# EAGLE design Counter (EAGLE 9.1.1)
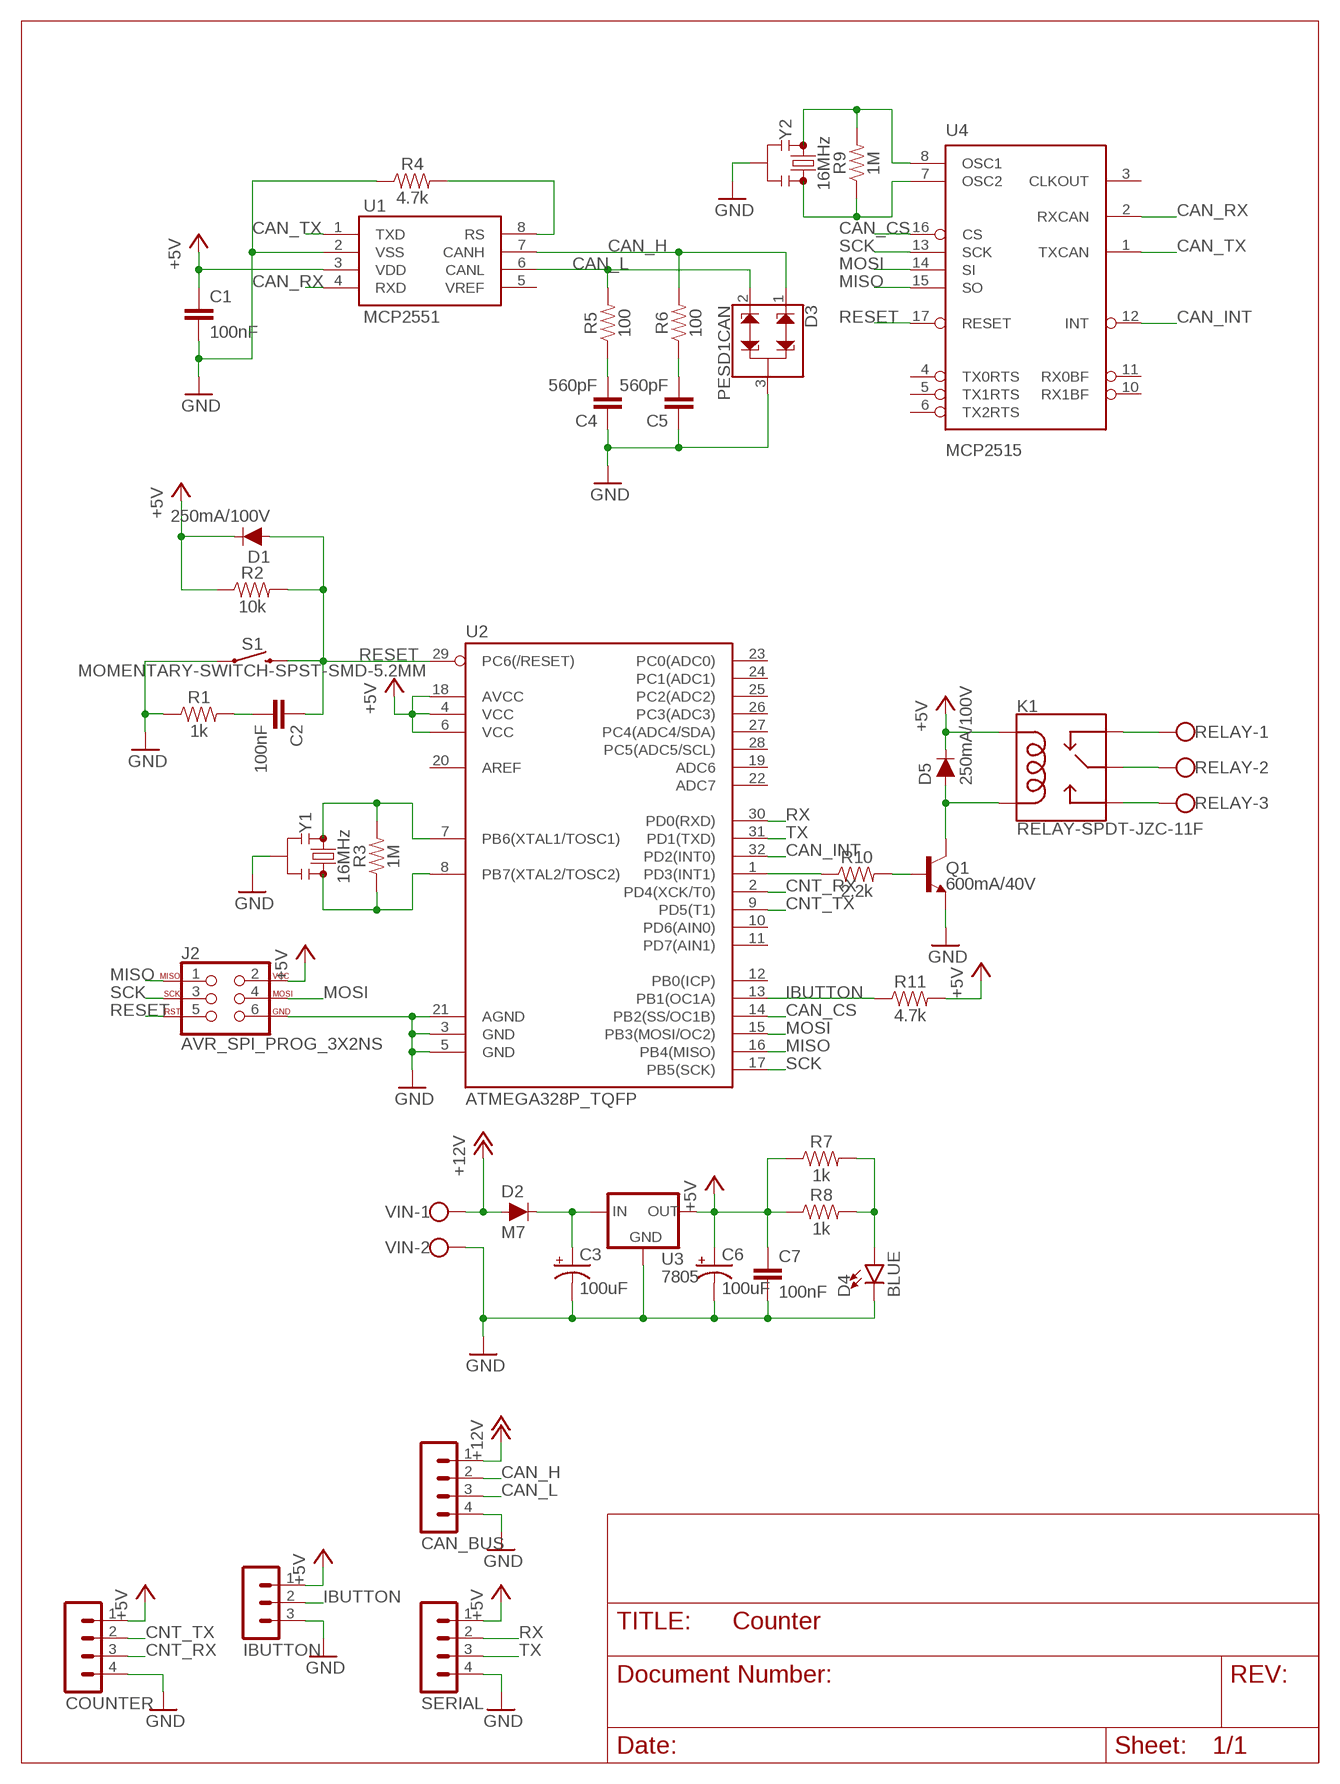
[diagram p0: schematic, sheet 1]

## Parts
C1  100nF  47NF-0603-25V-5%  [0603]
C2  100nF  47NF-0603-25V-5%  [0603]
C3  100uF  47UF-POLAR-PANASONIC_D-35V-20%  [PANASONIC_D]
C4  560pF  560PF-0603-50V-5%  [0603]
C5  560pF  560PF-0603-50V-5%  [0603]
C6  100uF  47UF-POLAR-PANASONIC_D-35V-20%  [PANASONIC_D]
C7  100nF  47NF-0603-25V-5%  [0603]
CAN_BUS  MA04-1  [MA04-1]
COUNTER  MA04-1  [MA04-1]
D1  250mA/100V  DIODE-BAS16J  [SOD-323]
D2  M7  DIODE-BAS16J  [SOD-323]
D3  PESD1CAN  [SOT23-3]
D4  BLUE  LED-BLUE0603  [LED-0603]
D5  250mA/100V  DIODE-BAS16J  [SOD-323]
IBUTTON  MA03-1  [MA03-1]
J2  AVR_SPI_PROG_3X2NS  [2X3-NS]
K1  RELAY-SPDT-JZC-11F  [RELAY-JZC]
Q1  600mA/40V  TRANS_NPN-MMBT2222AL  [SOT23-3]
R1  1k  1KOHM-0603-1/10W-1%  [0603]
R2  10k  10KOHM-0603-1/10W-1%  [0603]
R3  1M  1MOHM-0603-1/4W-5%  [0603]
R4  4.7k  4.7KOHM-0603-1/10W-1%  [0603]
R5  100  100OHM-0603-1/10W-1%  [0603]
R6  100  100OHM-0603-1/10W-1%  [0603]
R7  1k  1KOHM-0603-1/10W-1%  [0603]
R8  1k  1KOHM-0603-1/10W-1%  [0603]
R9  1M  1MOHM-0603-1/4W-5%  [0603]
R10  2.2k  2.2KOHM-0603-1/10W-1%  [0603]
R11  4.7k  4.7KOHM-0603-1/10W-1%  [0603]
RELAY  W237-103  [W237-103]
S1  MOMENTARY-SWITCH-SPST-SMD-5.2MM  [TACTILE_SWITCH_SMD_5.2MM]
SERIAL  MA04-1  [MA04-1]
U1  MCP2551  [SO08]
U2  ATMEGA328P_TQFP  [TQFP32-08]
U3  7805  V_REG_78XX7812  [TO-252]
U4  MCP2515  MCP2515(MCP2510)SO  [SO18W]
VIN  W237-102  [W237-102]
Y1  16MHz  RESONATOR-16MHZSMD_3.2X1.3  [RESONATOR-SMD-3.2X1.3]
Y2  16MHz  RESONATOR-16MHZSMD_3.2X1.3  [RESONATOR-SMD-3.2X1.3]

## Nets
+5V: C1.1 C6.+ C7.1 COUNTER.1 D1.C D5.C IBUTTON.1 J2.2 K1.5(COIL1) R2.1 R7.1 R8.1 R11.2 SERIAL.1 U1.3(VDD) U2.4(VCC) U2.6(VCC) U2.18(AVCC) U3.2(OUT)
+12V: CAN_BUS.1 D2.A VIN.1
CAN_CS: U2.14(PB2(SS/OC1B)) U4.16(CS)
CAN_H: CAN_BUS.2 D3.1 R6.2 U1.7(CANH)
CAN_INT: U2.32(PD2(INT0)) U4.12(INT)
CAN_L: CAN_BUS.3 D3.2 R5.2 U1.6(CANL)
CAN_RX: U1.4(RXD) U4.2(RXCAN)
CAN_TX: U1.1(TXD) U4.1(TXCAN)
CNT_RX: COUNTER.3 U2.2(PD4(XCK/T0))
CNT_TX: COUNTER.2 U2.9(PD5(T1))
GND: C1.2 C3.- C4.1 C5.1 C6.- C7.2 CAN_BUS.4 COUNTER.4 D3.3 D4.C IBUTTON.3 J2.6 Q1.2(E) R1.1 R4.1 S1.1 SERIAL.4 U1.2(VSS) U2.3(GND) U2.5(GND) U2.21(AGND) U3.3(GND) VIN.2 Y1.2 Y2.2
IBUTTON: IBUTTON.2 R11.1 U2.13(PB1(OC1A))
MISO: J2.1 U2.16(PB4(MISO)) U4.15(SO)
MOSI: J2.4 U2.15(PB3(MOSI/OC2)) U4.14(SI)
N$1: R3.1 U2.8(PB7(XTAL2/TOSC2)) Y1.3
N$2: C3.+ D2.C U3.1(IN)
N$3: R3.2 U2.7(PB6(XTAL1/TOSC1)) Y1.1
N$4: D4.A R7.2 R8.2
N$5: R4.2 U1.8(RS)
N$6: C2.2 R1.2
N$7: K1.4(MAIN) RELAY.2
N$8: C5.2 R6.1
N$9: C4.2 R5.1
N$10: K1.2(NC) RELAY.1
N$11: K1.3(NO) RELAY.3
N$12: Q1.1(B) R10.2
N$13: D5.A K1.1(COIL2) Q1.3(C)
N$14: R10.1 U2.1(PD3(INT1))
N$17: R9.1 U4.7(OSC2) Y2.3
N$18: R9.2 U4.8(OSC1) Y2.1
RESET: C2.1 D1.A J2.5 R2.2 S1.3 U2.29(PC6(/RESET)) U4.17(RESET)
RX: SERIAL.2 U2.30(PD0(RXD))
SCK: J2.3 U2.17(PB5(SCK)) U4.13(SCK)
TX: SERIAL.3 U2.31(PD1(TXD))
Unconnected: U1.5(VREF) U2.10(PD6(AIN0)) U2.11(PD7(AIN1)) U2.12(PB0(ICP)) U2.19(ADC6) U2.20(AREF) U2.22(ADC7) U2.23(PC0(ADC0)) U2.24(PC1(ADC1)) U2.25(PC2(ADC2)) U2.26(PC3(ADC3)) U2.27(PC4(ADC4/SDA)) U2.28(PC5(ADC5/SCL)) U4.3(CLKOUT) U4.4(TX0RTS) U4.5(TX1RTS) U4.6(TX2RTS) U4.10(RX1BF) U4.11(RX0BF)

## Power pins joined to a net without a drawn wire
+5V: U4.18(VDD)
GND: U4.9(VSS)

## Library data of the parts
C1 C2 C7 = SparkFun-Capacitors:47NF: 47nF ceramic capacitors A capacitor is a passive two-terminal electrical component used to store electrical energy temporarily in an electric field.; PROD_ID: CAP-08605; VALUE: 47nF
C3 C6 = SparkFun-Capacitors:47UF-POLAR: 47µF polarized capacitors A capacitor is a passive two-terminal electrical component used to store electrical energy temporarily in an electric field.; PROD_ID: CAP-08478; VALUE: 47uF
C4 C5 = SparkFun-Capacitors:560PF: 0.56nF/560pF ceramic capacitors A capacitor is a passive two-terminal electrical component used to store electrical energy temporarily in an electric field.; PROD_ID: CAP-08749
CAN_BUS COUNTER SERIAL = con-lstb:MA04-1: PIN HEADER; OC_FARNELL: unknown; OC_NEWARK: unknown
D1 D5 = SparkFun-DiscreteSemi:DIODE: Diode These are standard reverse protection diodes and small signal diodes. SparkFun Products: SparkFun SparkPunk Sound Kit <https://www.sparkfun.com/products/11177> SparkFun ESP8266 Thing <https://www.sparkfun.com/products/13231>; PROD_ID: DIO-09646
D2 = SparkFun-DiscreteSemi:DIODE: Diode These are standard reverse protection diodes and small signal diodes. SparkFun Products: SparkFun SparkPunk Sound Kit <https://www.sparkfun.com/products/11177> SparkFun ESP8266 Thing <https://www.sparkfun.com/products/13231>; PROD_ID: DIO-09646; VALUE: 250mA/100V
D3 = SparkFun-DiscreteSemi:PESD1CAN: CAN bus ESD protection diode PESD1CAN is used to protect two CAN bus lines from ESD. Link to datasheet <http://www.nxp.com/documents/data_sheet/PESD1CAN-U.pdf> SparkFun Products: SparkFun CAN-BUS Shield <https://www.sparkfun.com/products/13262>; PROD_ID: DIO-12501
D4 = SparkFun-LED:LED-BLUE: Blue SMD LED Used in manufacturing of various products at SparkFun Packages: 0603 - SMD 0603 package [Product Link] <http://www.digikey.com/product-detail/en/SMLE12BC7TT86/511-1589-2-ND/1641808> 1206 - SMD1206 package [Product Link] <http://www.digikey.com/product-detail/en/lite-on-inc/LTST-C150TBKT/160-1643-1-ND/573584> SparkFun Products: ESP8266 Thing-Dev Board <https://www.sparkfun.com/products/13711> RedBoard <https://www.sparkfun.com/products/12757>; PROD_ID: DIO-08575
IBUTTON = con-lstb:MA03-1: PIN HEADER; OC_FARNELL: unknown; OC_NEWARK: unknown
J2 = SparkFun-Connectors:AVR_SPI_PROG_3X2: AVR ISP 6 Pin This is the reduced ISP connector for AVR programming. Common on Arduino. This footprint will take up less PCB space and can be used with a 10-pin to 6-pin adapter such as SKU: BOB-08508 **Special note about "TEST_POINT" package. The stop mask is on the top side, so if you want your programming test points to be on the bottom of your board, make sure to place this package on the bottom side of the board. This also ensure that the orientation to program from the bottom side will be correct. SparkFun Products: SparkFun ISP Pogo Adapter <https://www.sparkfun.com/products/11591> - NS Tiny AVR Programmer <https://www.sparkfun.com/products/11801> -PTH
K1 = SparkFun-Electromechanical:RELAY-SPDT: SPDT Electromechanical Relay Single-pole, double-throw sealed relays. When current is applied to the coil, it throws a simple changeover switch, terminating the connection from the NC contact to ground and closing the NO contact. Use them to switch high voltage/high current devices. SparkFun Products JQX-15F: Relay SPDT Sealed - 20A <https://www.sparkfun.com/products/10924> (COM-10924) JZC-11F: Relay SPDT Sealed <https://www.sparkfun.com/products/100> (COM-00100); PROD_ID: COMP-09533; SF_SKU: COM-00100
Q1 = SparkFun-DiscreteSemi:TRANS_NPN: NPN transistor Current controlled devices typically used to amplify current or used as a switch. BC547 - COM-08928 <http://www.sparkfun.com/products/8928> (TO-92 45V 100mA) (1.Collector 2.Base 3.Emitter) 2N3904 - COM-00521 <http://www.sparkfun.com/products/521> (TO-92 40V 200mA) (1.Emitter 2.Base 3.Collector) P2N2222A - COM-12852 <http://www.sparkfun.com/products/12852> (TO-92 40V 600mA) (1.Collector 2.Base 3.Emitter); PROD_ID: TRANS-08049
R1 R7 R8 = SparkFun-Resistors:1KOHM: 1kΩ resistor A resistor is a passive two-terminal electrical component that implements electrical resistance as a circuit element. Resistors act to reduce current flow, and, at the same time, act to lower voltage levels within circuits. - Wikipedia; PROD_ID: RES-07856
R2 = SparkFun-Resistors:10KOHM: 10kΩ resistor A resistor is a passive two-terminal electrical component that implements electrical resistance as a circuit element. Resistors act to reduce current flow, and, at the same time, act to lower voltage levels within circuits. - Wikipedia; PROD_ID: RES-00824
R3 R9 = SparkFun-Resistors:1MOHM: 1MΩ resistor A resistor is a passive two-terminal electrical component that implements electrical resistance as a circuit element. Resistors act to reduce current flow, and, at the same time, act to lower voltage levels within circuits. - Wikipedia; PROD_ID: RES-07868
R4 R11 = SparkFun-Resistors:4.7KOHM: 4.7kΩ resistor A resistor is a passive two-terminal electrical component that implements electrical resistance as a circuit element. Resistors act to reduce current flow, and, at the same time, act to lower voltage levels within circuits. - Wikipedia; PROD_ID: RES-07857
R5 R6 = SparkFun-Resistors:100OHM: 100Ω resistor A resistor is a passive two-terminal electrical component that implements electrical resistance as a circuit element. Resistors act to reduce current flow, and, at the same time, act to lower voltage levels within circuits. - Wikipedia; PROD_ID: RES-07863
R10 = SparkFun-Resistors:2.2KOHM: 2.2kΩ resistor A resistor is a passive two-terminal electrical component that implements electrical resistance as a circuit element. Resistors act to reduce current flow, and, at the same time, act to lower voltage levels within circuits. - Wikipedia; PROD_ID: RES-08272
RELAY = con-wago-500:W237-103: WAGO SCREW CLAMP; MPN: 237-103; OC_FARNELL: unknown; OC_NEWARK: 18M7116
S1 = SparkFun-Switches:MOMENTARY-SWITCH-SPST: Momentary Switch (Pushbutton) - SPST Normally-open (NO) SPST momentary switches (buttons, pushbuttons). Variants PTH-12MM - 12mm square, through-hole Momentary Pushbutton Switch - 12mm Square <https://www.sparkfun.com/products/9190> (COM-09190) PTH-6.0MM, PTH-6.0MM-KIT - 6.0mm square, through-hole Mini Pushbutton Switch <https://www.sparkfun.com/products/97> (COM-00097) KIT package intended for soldering kit's - only one side of pads' copper is exposed. PTH-RIGHT-ANGLE-KIT - Right-angle, through-hole Right Angle Tactile Button <https://www.sparkfun.com/products/10791> - Used on SparkFun BigTime Watch Kit <https://www.sparkfun.com/products/11734> SMD-12MM - 12mm square, surface-mount Tactile Button - SMD (12mm) <https://www.sparkfun.com/products/12993> (COM-12993) Used on SparkFun PicoBoard <https://www.sparkfun.com/products/11888> SMD-4.5MM - 4.5mm Square Trackball Switch Used on SparkFun Blackberry Trackballer Breakout <https://www.sparkfun.com/products/13169> SMD-4.6MMX2.8MM - 4.60mm x 2.80mm, surface mount Used on SparkFun SAMD21 Mini Breakout <https://www.sparkfun.com/products/13664> SMD-5.2MM, SMD-5.2-REDUNDANT - 5.2mm square, surface-mount Mini Pushbutton Switch - SMD <https://www.sparkfun.com/products/8720> (COM-08720) Used on Arduino Pro Mini <https://www.sparkfun.com/products/11114> REDUNDANT package connects both switch circuits together SMD-6.0X3.5MM - 6.0 x 3.5mm, surface mount Momentary Reset Switch SMD <https://www.sparkfun.com/products/8229> (COM-08229) SMD-6.2MM-TALL - 6.2mm square, surface mount Tactile Button - SMD (6mm) <https://www.sparkfun.com/products/12992> Used on SparkFun Digital Sandbox <https://www.sparkfun.com/products/12651> SMD-RIGHT-ANGLE - Right-angle, surface mount Used on SparkFun Block for Intel® Edison - Arduino <https://www.sparkfun.com/products/13036>; PROD_ID: SWCH-08247; SF_SKU: COM-08720
U1 = SparkFun-IC-Comms:MCP2551: MCP2551 High Speed CAN Transceiver High speed CAN transceiver Datasheet <http://www.sparkfun.com/datasheets/DevTools/Arduino/MCP2551.pdf> SparkFun Products CAN-BUS Shield <https://www.sparkfun.com/products/13262> (DEV-13262) SparkFun OBD-II UART <https://www.sparkfun.com/products/9555> (WIG-09555); PROD_ID: IC-09907
U2 = SparkFun-IC-Microcontroller:ATMEGA328P_TQFP: Popular 328P in QFP Storefront component: ATmega328 - TQFP <https://www.sparkfun.com/products/13448> (COM-13448) Datasheet <http://www.sparkfun.com/datasheets/Components/SMD/ATMega328.pdf> SparkFun Products SparkFun RedBoard - Programmed with Arduino <https://www.sparkfun.com/products/12757> (DEV-12757) Arduino Pro Mini 328 - 5V/16MHz <https://www.sparkfun.com/products/11113> (DEV-11113) Arduino Pro Mini 328 - 3.3V/8MHz <https://www.sparkfun.com/products/11114> (DEV-11114) SparkFun OpenLog <https://www.sparkfun.com/products/13712> (DEV-13712) SparkFun MicroView - OLED Arduino Module <https://www.sparkfun.com/products/12923> (DEV-12923) SparkFun Digital Sandbox <https://www.sparkfun.com/products/12651> (DEV-12651) SparkFun PicoBoard <https://www.sparkfun.com/products/11888> (WIG-11888) Arduino Fio <https://www.sparkfun.com/products/10116> (DEV-10116) LilyPad Arduino 328 Main Board <https://www.sparkfun.com/products/13342> (DEV-13342) SparkFun RedStick <https://www.sparkfun.com/products/13741> (DEV-13741) LilyPad MP3 <https://www.sparkfun.com/products/11013> (DEV-11013) LilyPad Arduino SimpleSnap <https://www.sparkfun.com/products/10941> (DEV-10941) SparkFun Stepoko <https://www.sparkfun.com/products/13899> (ROB-13899) SparkFun Geiger Counter <https://www.sparkfun.com/products/11345> (SEN-11345) SparkFun EL Sequencer <https://www.sparkfun.com/products/12781> (COM-12781) Arduino Pro 328 - 5V/16MHz <https://www.sparkfun.com/products/10915> (DEV-10915) CryptoCape <https://www.sparkfun.com/products/12773> (DEV-12773) SparkFun IR Thermometer Evaluation Board - MLX90614 <https://www.sparkfun.com/products/10740> (SEN-10740) SparkFun RedBot Mainboard <https://www.sparkfun.com/products/12097> (ROB-12097) Arduino Pro 328 - 3.3V/8MHz <https://www.sparkfun.com/products/10914> (DEV-10914) SparkFun Block for Intel® Edison - Arduino <https://www.sparkfun.com/products/13036> (DEV-13036) SparkFun Simon Says - Surface Mount Soldering Kit <https://www.sparkfun.com/products/10935> (KIT-10935) SparkFun 7-Segment Serial Display - Red <https://www.sparkfun.com/products/11441> (COM-11441) SparkFun 7-Segment Serial Display - White <https://www.sparkfun.com/products/11629> (COM-11629) SparkFun 7-Segment Serial Display - Yellow <https://www.sparkfun.com/products/11443> (COM-11443) SparkFun 7-Segment Serial Display - Kelly Green <https://www.sparkfun.com/products/11440> (COM-11440) SparkFun 7-Segment Serial Display - Blue <https://www.sparkfun.com/products/11442> (COM-11442) SparkFun OpenSegment Serial Display - 20mm (Blue) <https://www.sparkfun.com/products/11647> (COM-11647) SparkFun OpenSegment Serial Display - 20mm (Green) <https://www.sparkfun.com/products/11646> (COM-11646) SparkFun OpenSegment Serial Display - 20mm (White) <https://www.sparkfun.com/products/11648> (COM-11648) SparkFun OpenSegment Serial Display - 20mm (Red) <https://www.sparkfun.com/products/11644> (COM-11644) SparkFun OpenSegment Serial Display - 20mm (Yellow) <https://www.sparkfun.com/products/11645> (COM-11645) SparkFun OpenSegment Shield <https://www.sparkfun.com/products/13190> (DEV-13190); PROD_ID: IC-09069
U3 = SparkFun-IC-Power:V_REG_78XX: Voltage Regulator Standard 78xx regulator. IGO (Input Ground Output). Spark Fun Electronics SKU : COM-00107; PROD_ID: VREG-12370; VALUE: +12v
U4 = SparkFun-IC-Comms:MCP2515(MCP2510): CAN controller with SPI interface The MCP2515 controller supercedes the MCP2510 while addressing all errata associated with it. The two devices are pin compatible, either can be used with this device. 18-pin package SOIC Simple SPI interface to any MCU. One-shot mode ensures message transmission is attempted only once Databyte filtering Start-of-Frame (SOF) output Low-power CMOS Technology Datasheet <http://www.sparkfun.com/datasheets/DevTools/Arduino/MCP2515.pdf> SparkFun Products CAN-BUS Shield <https://www.sparkfun.com/products/13262> (DEV-13262); PROD_ID: IC-09906
VIN = con-wago-500:W237-102: WAGO SCREW CLAMP; MPN: 237-102; OC_FARNELL: unknown; OC_NEWARK: 70K9898
Y1 Y2 = SparkFun-Clocks:RESONATOR-16MHZ: 16MHz Resonator Digikey Example <http://www.digikey.com/product-detail/en/murata-electronics-north-america/CSTCE16M0V53-R0/490-1198-1-ND/584635> Frequency: 16MHz Frequency Stability: ±0.3% Frequency Tolerance: ±0.5% Capacitance: 15pF SparkFun Products SparkFun OpenLog <https://www.sparkfun.com/products/13712> SparkFun MicroView - OLED Arduino Module <https://www.sparkfun.com/products/12923>; PROD_ID: XTAL-08900

## Board
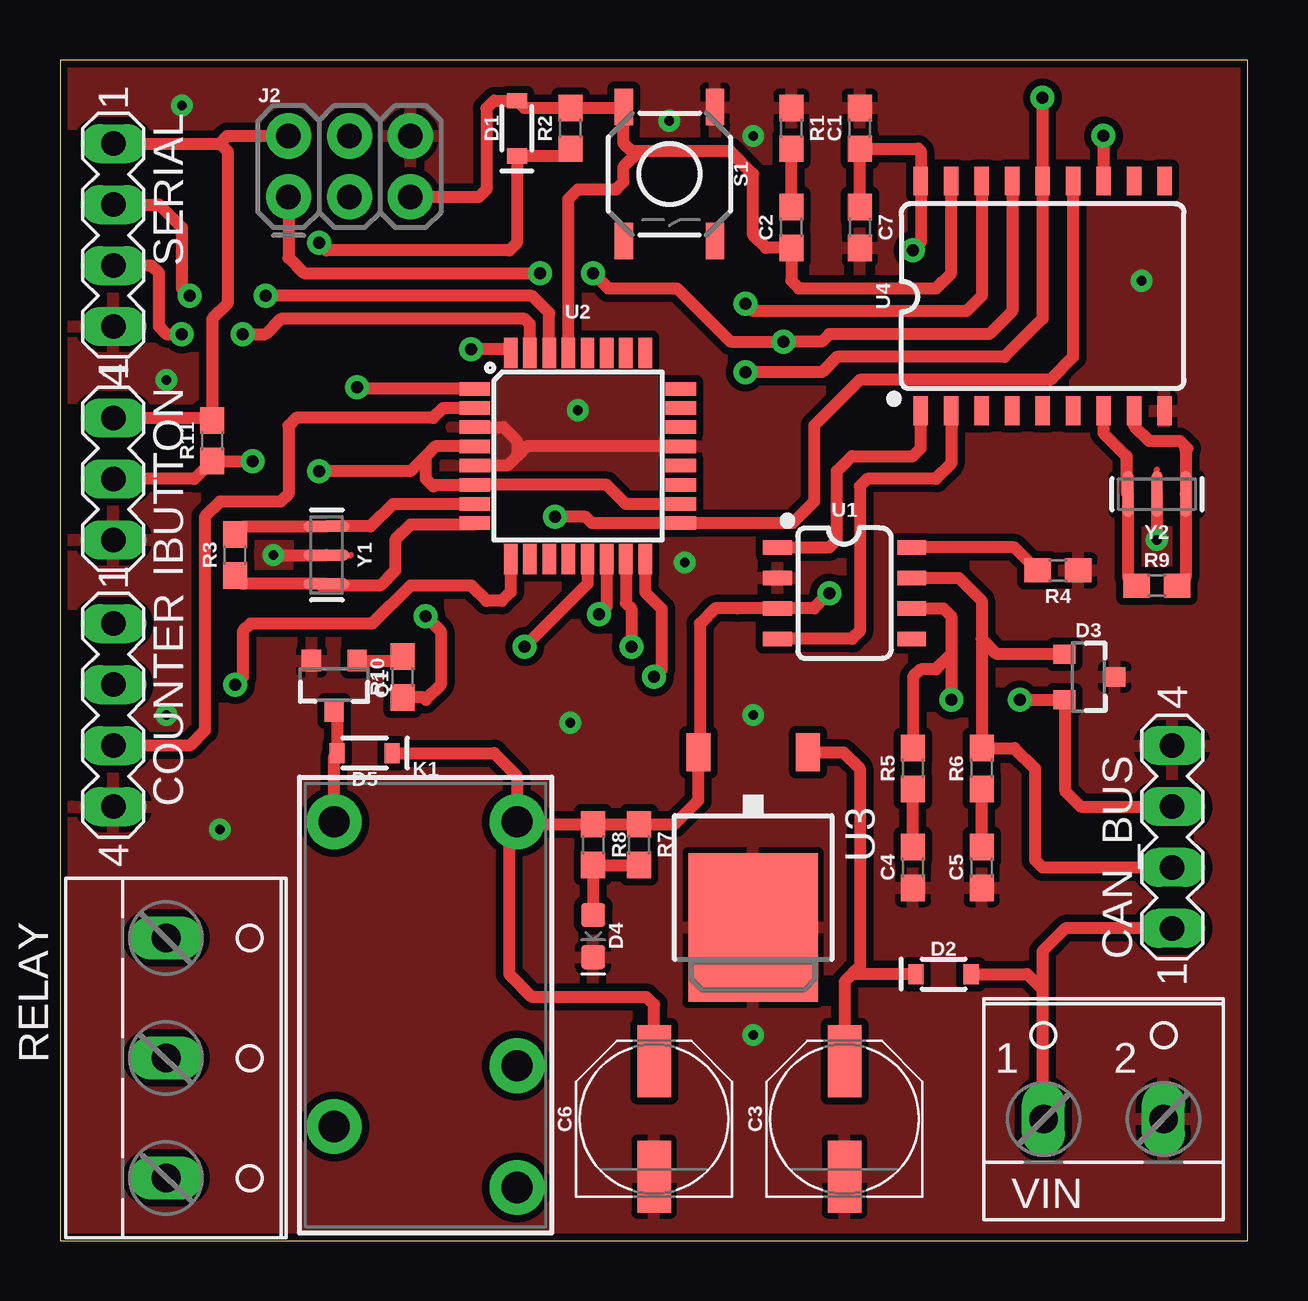
[diagram p1: board, top side]
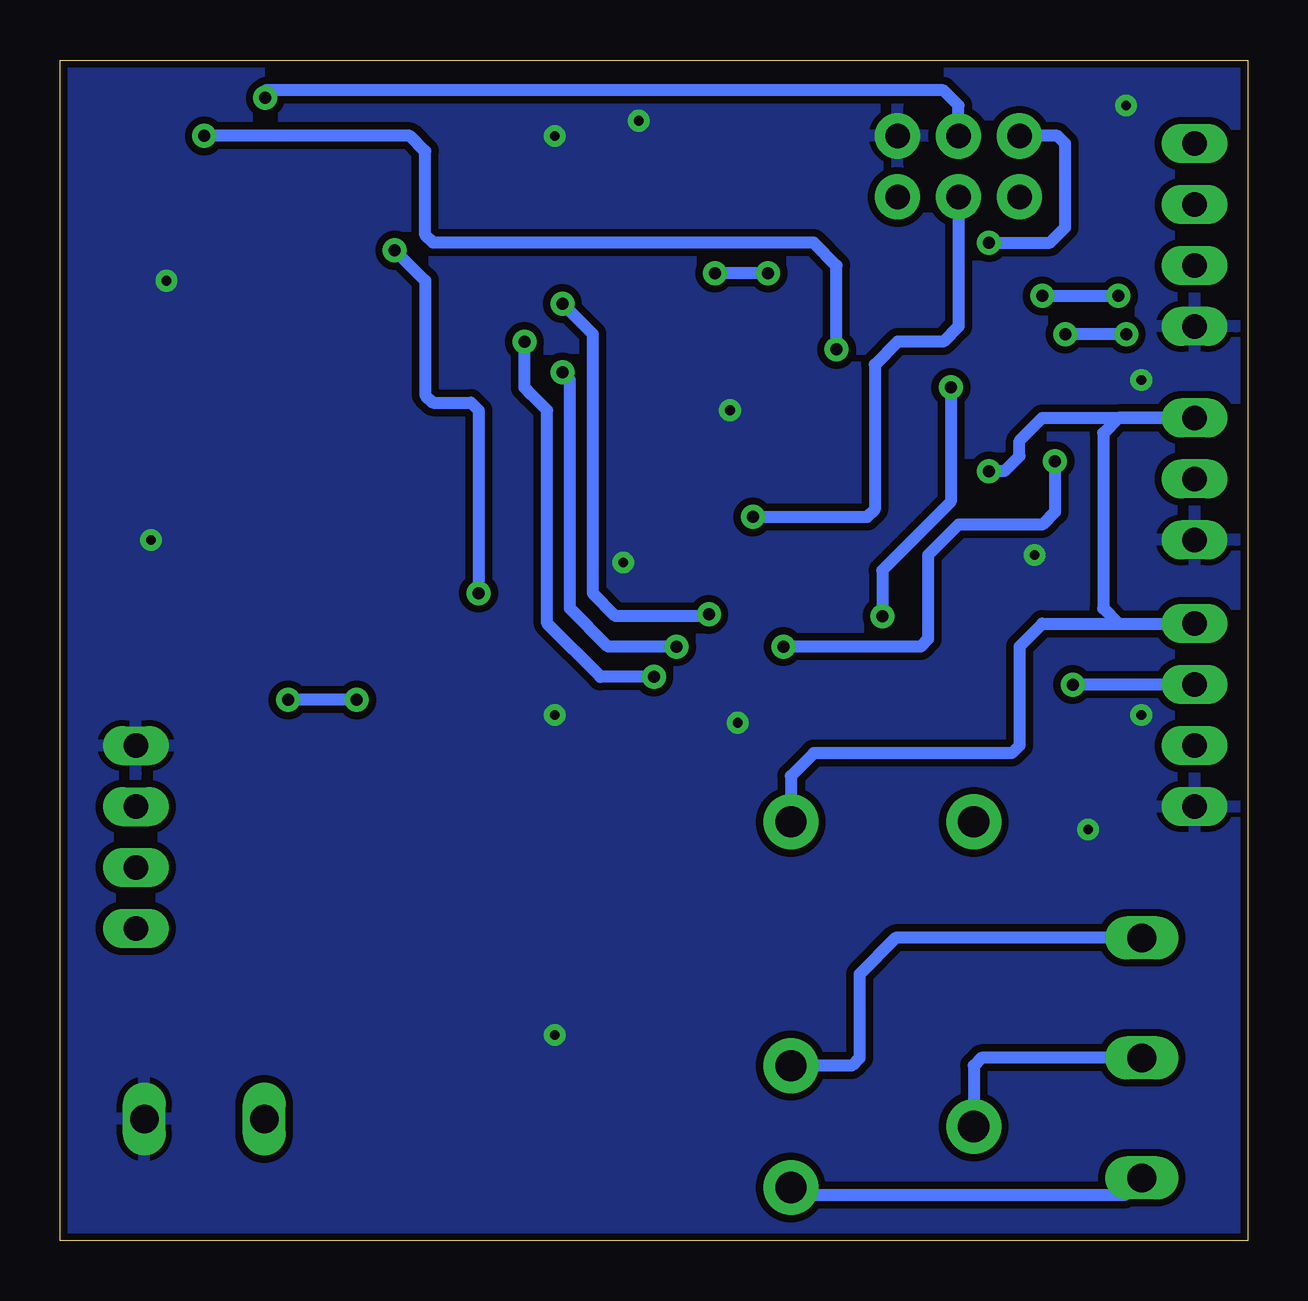
[diagram p2: board, bottom side, seen from below]

Size 49.52 x 49.2 mm. Coordinates in mm from the lower left corner, seen from the top.
Outline: 0,0 49.52,0 49.52,49.2 0,49.2 0,0
Copper layers (1*16): Top 0.035mm / dielectric 1.5mm / Bottom 0.035mm
Design rules "REVISION COLCIRCUITOS": minimum track width 0.23mm, minimum drill 0.4mm, track to track 0.2mm, track to pad 0.2mm, pad to pad 0.2mm, via to via 0.2mm, smd to smd 0mil, copper to edge 0.25mm, drill to drill 0.4mm, minimum pad ring 0.3mm, minimum via ring 0.25mm, stop-mask expansion 0.15mm, vias tented up to drill 0.001mm, thermal gap 10mil

### Footprints (pad centres in the part's own frame; a part is rotated, then mirrored left to right if it is on the bottom)
0603 = smd 1.1 x 1: 1 -0.85,0; 2 0.85,0
PANASONIC_D = smd 3 x 1.4: + 2.4,0; - -2.4,0
MA04-1 = drill 1.016 long: 1 -3.81,0; 2 -1.27,0; 3 1.27,0; 4 3.81,0
SOD-323 = smd 0.63 x 0.83: A 1.15,0; C -1.15,0
SOT23-3 = smd 0.8 x 0.9: 1 -0.95,-1; 2 0.95,-1; 3 0,1.1
LED-0603 = smd 1 x 1: A -0.877,0; C 0.877,0
MA03-1 = drill 1.016 long: 1 -2.54,0; 2 0,0; 3 2.54,0
2X3-NS = drill 1.016 pad 1.88: 1 -2.54,-1.27; 2 -2.54,1.27; 3 0,-1.27; 4 0,1.27; 5 2.54,-1.27; 6 2.54,1.27
RELAY-JZC = drill 1.3 pad 2.286: 1 3.81,-8.89; 2 -3.81,1.27; 3 -3.81,6.35; 4 3.81,3.81; 5 -3.81,-8.89
W237-103 = drill 1.194 long: 1 -5,-1.29; 2 0,-1.29; 3 5,-1.29
TACTILE_SWITCH_SMD_5.2MM = smd 1.524 x 0.762: 1 -2.794,1.905; 2 2.794,1.905; 3 -2.794,-1.905; 4 2.794,-1.905
SO08 = smd 0.6 x 1.2: 1 -1.905,-2.8; 2 -0.635,-2.8; 3 0.635,-2.8; 4 1.905,-2.8; 5 1.905,2.8; 6 0.635,2.8; 7 -0.635,2.8; 8 -1.905,2.8
TQFP32-08 = smd 1.27 x 0.559: 1 -4.293,2.8; 2 -4.293,2; 3 -4.293,1.2; 4 -4.293,0.4; 5 -4.293,-0.4; 6 -4.293,-1.2; 7 -4.293,-2; 8 -4.293,-2.8; 17 4.293,-2.8; 18 4.293,-2; 19 4.293,-1.2; 20 4.293,-0.4; 21 4.293,0.4; 22 4.293,1.2; 23 4.293,2; 24 4.293,2.8 | smd 0.559 x 1.27: 9 -2.8,-4.293; 10 -2,-4.293; 11 -1.2,-4.293; 12 -0.4,-4.293; 13 0.4,-4.293; 14 1.2,-4.293; 15 2,-4.293; 16 2.8,-4.293; 25 2.8,4.293; 26 2,4.293; 27 1.2,4.293; 28 0.4,4.293; 29 -0.4,4.293; 30 -1.2,4.293; 31 -2,4.293; 32 -2.8,4.293
TO-252 = smd 1 x 1.6: 1 -2.28,-4.8; 2 2.28,-4.8 | smd 5.4 x 6.2: 3 0,2.5
SO18W = smd 0.6 x 1.2: 1 -5.08,-4.788; 2 -3.81,-4.788; 3 -2.54,-4.788; 4 -1.27,-4.788; 5 0,-4.788; 6 1.27,-4.788; 7 2.54,-4.788; 8 3.81,-4.788; 9 5.08,-4.788; 10 5.08,4.788; 11 3.81,4.788; 12 2.54,4.788; 13 1.27,4.788; 14 0,4.788; 15 -1.27,4.788; 16 -2.54,4.788; 17 -3.81,4.788; 18 -5.08,4.788
W237-102 = drill 1.194 long: 1 -2.5,-1.27; 2 2.5,-1.27
RESONATOR-SMD-3.2X1.3 = smd 0.45 x 1.905: 1 -1.2,0; 2 0,0; 3 1.2,0

### Placement (x,y rotation side)
C1  33.34,46.35 90 top
C2  30.48,42.23 90 top
C3  32.7,5.08 90 top
C4  35.56,15.56 90 top
C5  38.42,15.56 90 top
C6  24.77,5.08 90 top
C7  33.34,42.23 270 top
CAN_BUS  46.35,16.83 90 top
COUNTER  2.22,21.91 270 top
D1  19.05,46.35 90 top
D2  36.83,11.11 0 top
D3  42.86,23.5 270 top
D4  22.23,12.7 270 top
D5  12.7,20.32 180 top
IBUTTON  2.22,31.75 270 top
J2  12.06,44.77 0 top
K1  15.24,8.57 180 top
Q1  11.43,23.18 180 top
R1  30.48,46.35 270 top
R2  21.27,46.35 90 top
R3  7.3,28.57 90 top
R4  41.59,27.94 180 top
R5  35.56,19.68 90 top
R6  38.42,19.68 90 top
R7  24.13,16.51 270 top
R8  22.23,16.51 270 top
R9  45.72,27.3 0 top
R10  14.29,23.5 90 top
R11  6.35,33.34 90 top
RELAY  5.71,7.62 270 top
S1  25.4,44.45 270 top
SERIAL  2.22,41.91 270 top
U1  32.7,26.99 270 top
U2  21.59,32.7 0 top
U3  28.89,15.56 180 top
U4  40.96,39.37 0 top
VIN  43.5,6.35 0 top
Y1  11.11,28.57 270 top
Y2  45.72,31.11 180 top

### Tracks (layer width: path | path; a pad name or v marks a point on that pad's centre or on a via)
+5V  (via drill 0.5, 0.5 pad 0.55)
  Top 0.508: 19.15,17.36 K1.5 19.05,19.37 18.1,20.32 D5.C | 19.15,17.36 R8.1 R7.1 25.61,17.36 26.61,18.36 U3.2 26.67,20.41 26.67,25.72 27.3,26.35 28.26,26.35 U1.3 31.43,26.35 v32.07,26.99 | C6.+ 24.77,9.84 24.45,10.16 19.68,10.16 18.73,11.11 18.73,16.94 19.15,17.36 | R2.1 20.97,45.2 D1.C 19.05,41.59 18.73,41.27 11.11,41.27 v10.79,41.59 | C7.1 C1.1 35.77,45.51 35.88,45.4 U4.18 35.88,41.59 v35.56,41.27 | U2.4 15.64,33.1 15.24,32.7 | 15.24,32.7 15.24,31.75 15.56,31.43 15.63,31.5 U2.6 22.79,31.5 23.59,30.7 U2.18 | 15.24,32.7 14.61,32.07 v10.79,32.07 | IBUTTON.1 6.03,34.29 6.35,34.61 R11.2 6.35,38.42 6.99,39.05 6.99,45.4 6.67,45.72 | SERIAL.1 6.67,45.72 | 6.67,45.72 6.99,46.04 J2.2
  Bottom 0.508: v10.79,32.07 10.16,32.07 9.53,32.7 9.53,33.34 8.57,34.29 IBUTTON.1 5.4,34.29 6.03,33.66 6.03,26.35 5.4,25.72 | v35.56,41.27 34.29,40.01 34.29,35.24 33.97,34.92 32.38,34.92 32.07,34.61 v32.07,26.99 | v10.79,41.59 8.26,41.59 7.62,42.23 7.62,45.72 7.94,46.04 J2.2 | K1.5 19.05,19.37 18.1,20.32 17.46,20.32 9.84,20.32 9.53,20.64 9.53,24.77 8.57,25.72 5.71,25.72 5.4,25.72 | 5.4,25.72 COUNTER.1
+12V
  Top 0.508: CAN_BUS.1 41.91,13.02 40.96,12.06 40.96,10.48 | VIN.1 40.96,5.12 40.96,10.48 | D2.A 40.32,11.11 40.96,10.48
CAN_CS  (via drill 0.5 pad 0.55)
  Top 0.508: U4.16 38.42,39.37 37.78,38.73 31.83,38.73 31.83,38.74 31.04,38.74 31.04,38.73 28.89,38.73 v28.57,39.05 | U2.14 22.79,26.42 v22.47,26.11
  Bottom 0.508: v28.57,39.05 27.46,37.94 27.3,37.78 27.3,26.99 26.35,26.04 22.54,26.04 v22.47,26.11
CAN_H
  Top 0.508: U1.7 37.47,27.62 38.42,26.67 38.42,25.08 | 38.42,25.08 R6.2 39.79,20.54 40.64,19.68 40.64,15.88 40.96,15.56 CAN_BUS.2 | D3.1 39.05,24.45 38.42,25.08
CAN_INT  (via drill 0.5 pad 0.55)
  Top 0.508: U2.32 18.64,37.15 v17.14,37.15 | v43.5,46.04 U4.12
  Bottom 0.508: v17.14,37.15 17.14,40.64 18.1,41.59 33.97,41.59 34.29,41.91 34.29,45.4 34.92,46.04 v43.5,46.04
CAN_L  (via drill 0.5 pad 0.55)
  Top 0.508: U1.6 36.83,26.35 37.15,26.04 37.15,24.45 | 37.15,24.45 36.51,23.81 35.88,23.81 35.56,23.5 R5.2 | v37.15,22.54 37.15,24.13 37.15,24.45 | v40.01,22.54 D3.2 41.86,22.27 41.91,22.23 41.91,18.73 42.55,18.1 CAN_BUS.3
  Bottom 0.508: v37.15,22.54 v40.01,22.54
CAN_RX
  Top 0.508: U4.2 37.15,32.38 36.51,31.75 33.66,31.75 33.34,31.43 33.34,25.4 33.02,25.08 U1.4
CAN_TX
  Top 0.508: U1.1 32.07,28.89 32.38,29.21 32.38,32.07 33.02,32.7 35.56,32.7 35.88,33.02 U4.1
CNT_RX
  Top 0.508: U2.2 15.97,34.7 15.56,34.29 9.84,34.29 9.53,33.97 9.53,31.11 9.21,30.8 6.67,30.8 6.03,30.16 6.03,21.27 5.4,20.64 COUNTER.3
CNT_TX  (via drill 0.5 pad 0.55)
  Top 0.508: U2.9 18.79,27.05 18.41,26.67 17.78,26.67 17.14,27.3 14.61,27.3 13.02,25.72 7.94,25.72 7.62,25.4 7.62,23.5 v7.3,23.18
  Bottom 0.508: COUNTER.2 v7.3,23.18
GND  (via drill 0.4)
  Top 0.508: U2.3 18.48,33.9 19.05,33.34 19.05,32.7 | U2.5 18.65,32.3 19.05,32.7 | U2.21 19.45,33.1 19.05,32.7 | Y2.2 v45.72,29.21 | v8.89,28.57 Y1.2
  other vias: 21.27,21.59 21.59,34.61 28.89,8.57 45.09,40.01 26.04,28.26 28.89,46.04 28.89,21.91 25.4,46.67 5.08,47.31 4.45,21.91 6.67,17.14 4.45,35.88
  pour Top (isolate 0.305): 0,48.9 0.32,49.21 49.21,49.21 49.53,48.9 49.53,0.32 49.21,0 0.32,0 0,0.32 0,48.58
  pour Bottom (isolate 0.305): 0,48.9 0.32,49.21 49.21,49.21 49.53,48.9 49.53,0.32 49.21,0 0.32,0 0,0.32
IBUTTON  (via drill 0.5 pad 0.55)
  Top 0.508: v8.04,32.49 R11.1 5.61,31.75 IBUTTON.2 | U2.13 21.99,27.39 v19.37,24.77
  Bottom 0.508: v8.04,32.49 8.04,30.38 8.57,29.84 12.06,29.84 13.34,28.57 13.34,25.08 13.65,24.77 v19.37,24.77
MISO  (via drill 0.5 pad 0.55)
  Top 0.508: U4.15 39.69,38.73 38.73,37.78 32.07,37.78 31.75,37.47 v30.16,37.47 27.94,37.47 25.72,39.69 22.86,39.69 v22.23,40.32 | U2.16 24.39,27.03 25.08,26.33 25.08,23.81 v24.77,23.5 | J2.1 9.53,40.96 10.16,40.32 v20,40.32
  Bottom 0.508: v24.77,23.5 26.99,23.5 29.21,25.72 29.21,34.61 29.84,35.24 30.16,35.56 v30.16,37.47 | v20,40.32 v22.23,40.32
MOSI  (via drill 0.5 pad 0.55)
  Top 0.508: U2.15 23.59,26.57 23.81,26.35 v23.81,24.77 | v40.96,47.62 U4.14 40.96,38.42 39.37,36.83 32.38,36.83 31.75,36.2 v28.57,36.2
  Bottom 0.508: v23.81,24.77 26.67,24.77 28.26,26.35 28.26,35.88 v28.57,36.2 | J2.4 12.06,47.31 12.69,47.93 40.96,47.93 v40.96,47.62
N$1
  Top 0.508: Y1.3 10.79,27.38 | 10.79,27.38 7.65,27.38 R3.1 | U2.8 17.24,29.84 14.61,29.84 13.97,29.21 13.97,27.94 13.34,27.3 10.87,27.3 10.79,27.38
N$2
  Top 0.508: 33.02,11.11 32.86,10.95 32.7,10.79 C3.+ | D2.C 33.02,11.11 | U3.1 32.66,20.36 33.34,19.68 33.34,11.43 33.02,11.11
N$3
  Top 0.508: R3.2 7.65,29.77 Y1.1 12.95,29.77 13.88,30.7 U2.7
N$4
  Top 0.508: R7.2 R8.2 D4.A
N$5
  Top 0.508: R4.2 39.79,28.89 U1.8
N$6
  Top 0.508: C2.2 R1.2
N$7
  Bottom 0.508: RELAY.2 11.11,7.62 11.43,7.3 K1.4
N$8
  Top 0.508: C5.2 R6.1
N$9
  Top 0.508: C4.2 R5.1
N$10
  Bottom 0.508: RELAY.1 14.69,12.62 16.19,11.11 16.19,7.62 16.51,7.3 K1.2
N$11
  Bottom 0.508: RELAY.3 5.14,1.91 18.73,1.91 K1.3
N$12
  Top 0.508: Q1.1 14.12,24.18 R10.2
N$13
  Top 0.508: Q1.3 11.55,21.96 D5.A 11.43,20.2 K1.1
N$14  (via drill 0.5 pad 0.55)
  Top 0.508: U2.1 12.44,35.5 v12.38,35.56 | v15.24,26.04 15.88,25.4 15.88,23.18 15.24,22.54 15.14,22.64 R10.1
  Bottom 0.508: v15.24,26.04 15.24,27.94 12.38,30.8 v12.38,35.56
N$17
  Top 0.508: R9.1 44.52,27.66 Y2.3 44.45,31.18 44.45,32.7 43.5,33.66 U4.7
N$18
  Top 0.508: R9.2 46.92,27.66 Y2.1 46.92,32.95 46.99,33.02 46.67,33.34 45.4,33.34 44.77,33.97 U4.8
RESET
  Top 0.508: 24.13,45.4 27.94,45.4 28.89,44.45 28.89,41.91 29.43,41.38 C2.1 30.48,40.01 30.8,39.69 36.51,39.69 37.15,40.32 U4.17 | 24.13,45.4 23.81,45.4 23.5,45.72 S1.3 23.46,47.2 R2.2 19.35,47.2 D1.A 18.1,47.51 17.78,47.19 17.78,43.81 17.46,43.5 J2.5 | U2.29 21.19,43.41 21.59,43.81 23.18,43.81 23.5,44.13 23.5,44.77 24.13,45.4
RX  (via drill 0.5 pad 0.55)
  Top 0.508: U2.30 20.39,38.66 19.68,39.37 v8.57,39.37 | SERIAL.2 4.13,43.18 5.08,42.23 5.08,39.69 v5.4,39.37
  Bottom 0.508: v8.57,39.37 v5.4,39.37
SCK  (via drill 0.5 pad 0.55)
  Top 0.508: U4.13 42.23,36.83 41.27,35.88 33.34,35.88 31.43,33.97 31.43,30.8 30.54,29.9 U2.17 22.17,29.9 21.91,30.16 v20.64,30.16
  Bottom 0.508: J2.3 12.06,38.1 12.7,37.47 14.61,37.47 15.56,36.51 15.56,30.48 15.88,30.16 v20.64,30.16
TX  (via drill 0.5 pad 0.55)
  Top 0.508: v5.08,37.78 4.45,37.78 4.13,38.1 4.13,40.32 3.81,40.64 SERIAL.3 | v7.62,37.78 8.57,37.78 9.21,38.42 19.37,38.42 19.59,38.2 U2.31
  Bottom 0.508: v5.08,37.78 v7.62,37.78